# Altium schematic sheet Boris_IO_3.SchDoc: Boris IO
size A4; Date: 2017.12.10; DrawnBy: Miklós Árpád; Revision: 1.0; SheetNumber: 3; SheetTotal: 5; PageSetup: Record=PageOptions|CenterHorizontal=True|CenterVertical=True|PrintScale=1.00|XCorrection=1.00|YCorrection=1.00|PrintKind=0|BorderSize=5000000|LeftOffset=0|BottomOffset=0|Orientation=2|PaperLength=1000|PaperWidth=1000|Scale=100|PaperSource=7|PrintQuality=-4|MediaType=1|DitherType=10|PaperKind=A4|PrintScaleMode=0
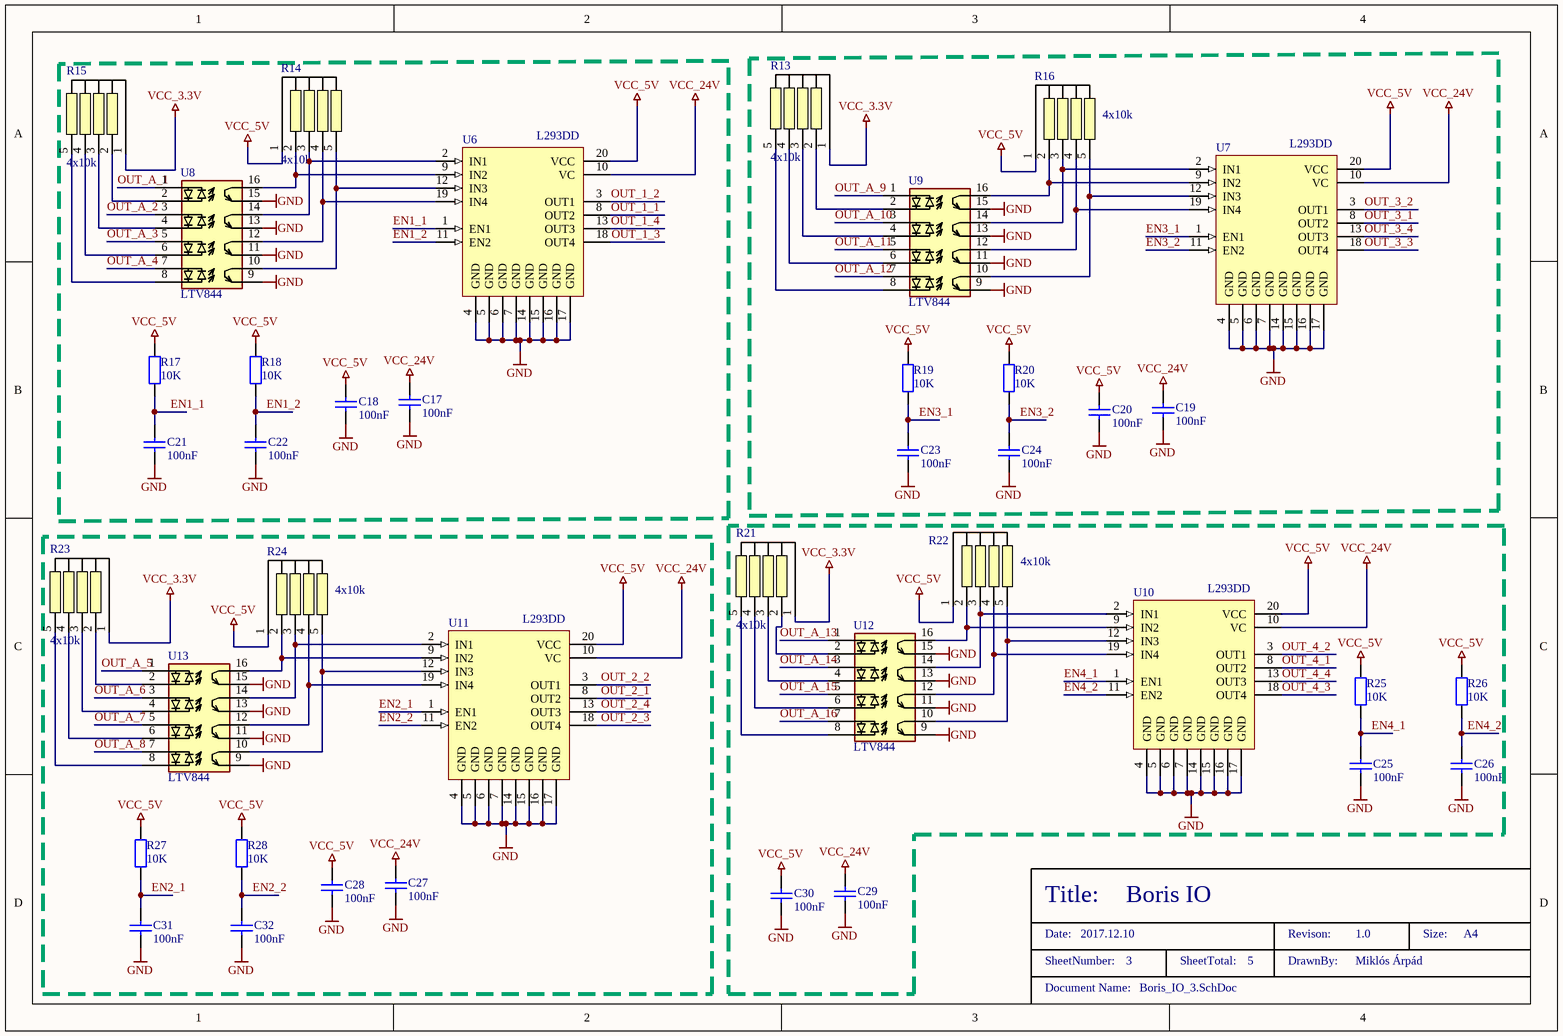
[diagram p0: Boris_IO_3.SchDoc]

## Parts
C17  100nF  [0805_CAP]
C18  100nF  [0805_CAP]
C19  100nF  [0805_CAP]
C20  100nF  [0805_CAP]
C21  100nF  [0805_CAP]
C22  100nF  [0805_CAP]
C23  100nF  [0805_CAP]
C24  100nF  [0805_CAP]
C25  100nF  [0805_CAP]
C26  100nF  [0805_CAP]
C27  100nF  [0805_CAP]
C28  100nF  [0805_CAP]
C29  100nF  [0805_CAP]
C30  100nF  [0805_CAP]
C31  100nF  [0805_CAP]
C32  100nF  [0805_CAP]
R13  4x10k  [NFD_SIL-RES-5]
R14  4x10k  [NFD_SIL-RES-5]
R15  4x10k  [NFD_SIL-RES-5]
R16  4x10k  [NFD_SIL-RES-5]
R17  10K  [0805_RES]
R18  10K  [0805_RES]
R19  10K  [0805_RES]
R20  10K  [0805_RES]
R21  4x10k  [NFD_SIL-RES-5]
R22  4x10k  [NFD_SIL-RES-5]
R23  4x10k  [NFD_SIL-RES-5]
R24  4x10k  [NFD_SIL-RES-5]
R25  10K  [0805_RES]
R26  10K  [0805_RES]
R27  10K  [0805_RES]
R28  10K  [0805_RES]
U6  L293DD  [SO20_N]
U7  L293DD  [SO20_N]
U8  LTV844  [LTV844S]
U9  LTV844  [LTV844S]
U10  L293DD  [SO20_N]
U11  L293DD  [SO20_N]
U12  LTV844  [LTV844S]
U13  LTV844  [LTV844S]

## Nets
GND: C17.2 C18.2 C19.2 C20.2 C21.2 C22.2 C23.2 C24.2 C25.2 C26.2 C27.2 C28.2 C29.2 C30.2 C31.2 C32.2 U6.4(GND) U6.5(GND) U6.6(GND) U6.7(GND) U6.14(GND) U6.15(GND) U6.16(GND) U6.17(GND) U7.4(GND) U7.5(GND) U7.6(GND) U7.7(GND) U7.14(GND) U7.15(GND) U7.16(GND) U7.17(GND) U8.9 U8.11 U8.13 U8.15 U9.9 U9.11 U9.13 U9.15 U10.4(GND) U10.5(GND) U10.6(GND) U10.7(GND) U10.14(GND) U10.15(GND) U10.16(GND) U10.17(GND) U11.4(GND) U11.5(GND) U11.6(GND) U11.7(GND) U11.14(GND) U11.15(GND) U11.16(GND) U11.17(GND) U12.9 U12.11 U12.13 U12.15 U13.9 U13.11 U13.13 U13.15
VCC_3.3V: R13.1 R15.1 R21.1 R23.1
VCC_5V: C18.1 C20.1 C28.1 C30.1 R14.1 R16.1 R17.2 R18.2 R19.2 R20.2 R22.1 R24.1 R25.2 R26.2 R27.2 R28.2 U6.20(VCC) U7.20(VCC) U10.20(VCC) U11.20(VCC)
VCC_24V: C17.1 C19.1 C27.1 C29.1 U6.10(VC) U7.10(VC) U10.10(VC) U11.10(VC)
EN1_1: C21.1 R17.1 U6.1(EN1)
EN1_2: C22.1 R18.1 U6.11(EN2)
EN2_1: C31.1 R27.1 U11.1(EN1)
EN2_2: C32.1 R28.1 U11.11(EN2)
EN3_1: C23.1 R19.1 U7.1(EN1)
EN3_2: C24.1 R20.1 U7.11(EN2)
EN4_1: C25.1 R25.1 U10.1(EN1)
EN4_2: C26.1 R26.1 U10.11(EN2)
OUT_1_1: U6.8(OUT2)
OUT_1_2: U6.3(OUT1)
OUT_1_3: U6.18(OUT4)
OUT_1_4: U6.13(OUT3)
OUT_2_1: U11.8(OUT2)
OUT_2_2: U11.3(OUT1)
OUT_2_3: U11.18(OUT4)
OUT_2_4: U11.13(OUT3)
OUT_3_1: U7.8(OUT2)
OUT_3_2: U7.3(OUT1)
OUT_3_3: U7.18(OUT4)
OUT_3_4: U7.13(OUT3)
OUT_4_1: U10.8(OUT2)
OUT_4_2: U10.3(OUT1)
OUT_4_3: U10.18(OUT4)
OUT_4_4: U10.13(OUT3)
OUT_A_1: U8.1
OUT_A_2: U8.3
OUT_A_3: U8.5
OUT_A_4: U8.7
OUT_A_5: U13.1
OUT_A_6: U13.3
OUT_A_7: U13.5
OUT_A_8: U13.7
OUT_A_9: U9.1
OUT_A_10: U9.3
OUT_A_11: U9.5
OUT_A_12: U9.7
OUT_A_13: U12.1
OUT_A_14: U12.3
OUT_A_15: U12.5
OUT_A_16: U12.7
NetR13_2: R13.2 U9.2
NetR13_3: R13.3 U9.4
NetR13_4: R13.4 U9.6
NetR13_5: R13.5 U9.8
NetR14_2: R14.2 U6.9(IN2) U8.16
NetR14_3: R14.3 U6.2(IN1) U8.14
NetR14_4: R14.4 U6.19(IN4) U8.12
NetR14_5: R14.5 U6.12(IN3) U8.10
NetR15_2: R15.2 U8.2
NetR15_3: R15.3 U8.4
NetR15_4: R15.4 U8.6
NetR15_5: R15.5 U8.8
NetR16_2: R16.2 U7.9(IN2) U9.16
NetR16_3: R16.3 U7.2(IN1) U9.14
NetR16_4: R16.4 U7.19(IN4) U9.12
NetR16_5: R16.5 U7.12(IN3) U9.10
NetR21_2: R21.2 U12.2
NetR21_3: R21.3 U12.4
NetR21_4: R21.4 U12.6
NetR21_5: R21.5 U12.8
NetR22_2: R22.2 U10.9(IN2) U12.16
NetR22_3: R22.3 U10.2(IN1) U12.14
NetR22_4: R22.4 U10.19(IN4) U12.12
NetR22_5: R22.5 U10.12(IN3) U12.10
NetR23_2: R23.2 U13.2
NetR23_3: R23.3 U13.4
NetR23_4: R23.4 U13.6
NetR23_5: R23.5 U13.8
NetR24_2: R24.2 U11.9(IN2) U13.16
NetR24_3: R24.3 U11.2(IN1) U13.14
NetR24_4: R24.4 U11.19(IN4) U13.12
NetR24_5: R24.5 U11.12(IN3) U13.10

## Notes on the sheet
- Title:
- Date:
- SheetNumber:
- Document Name:
- SheetTotal:
- Revison:
- DrawnBy:
- Size:
- A4

## Library data of the parts
C17-C32 = Cap: Capacitor; Value: 100nF; Catalog Number: 93-04-28; Distributor: RET; Name: 100nF
R13-R16 R21-R24 = SIL_10k: RET: *
R17-R20 R25-R28 = Res2: Resistor; Value: 10K; Catalog Number: 92-02-23; Distributor: RET; Name: 10K
U6 U7 U10 U11 = L293DD: Push-Pull Four Channel Driver With Diode; Published: 8-Jun-2000; LatestRevisionDate: 13-Apr-2006; LatestRevisionNote: IPC-7351 Footprint Added.; DatasheetVersion: Jun-1996; PackageVersion: Jul-2001; PackageReference: SO20; Publisher: Altium Limited; PackageDescription: 20-Pin Plastic Small Outline Integrated Circuit 1.27 mm Pitch; Code_JEDEC: MS-013-AC; Code_IPC: SOIC127P1030-20; ComponentLink1Description: Manufacturer Link; ComponentLink1URL: http://www.st.com/; ComponentLink2Description: Datasheet; ComponentLink2URL: http://www.st.com/stonline/products/literature/ds/1330/l293d.pdf
U8 U9 U12 U13 = LTV844: 4x optocoupler